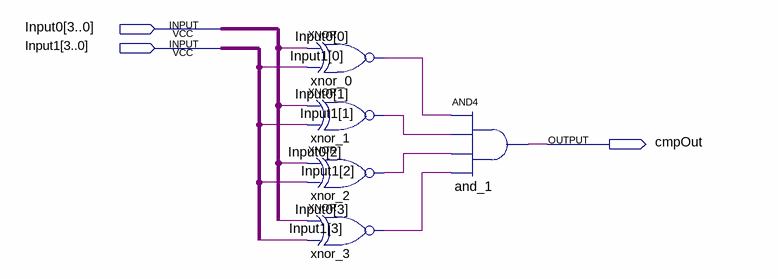
[diagram p0: schematic sheet]
// Quartus schematic EqCmp4.bdf as structural Verilog: 5 symbols, 3 pins
module EqCmp4 (
  input  [3:0] Input0,
  input  [3:0] Input1,
  output cmpOut
);

  wire xnor_0_out, xnor_1_out, xnor_2_out, xnor_3_out;

  xnor xnor_0 (xnor_0_out, Input0[0], Input1[0]);
  xnor xnor_1 (xnor_1_out, Input0[1], Input1[1]);
  xnor xnor_2 (xnor_2_out, Input0[2], Input1[2]);
  xnor xnor_3 (xnor_3_out, Input0[3], Input1[3]);
  and and_1 (cmpOut, xnor_0_out, xnor_1_out, xnor_2_out, xnor_3_out);
endmodule
